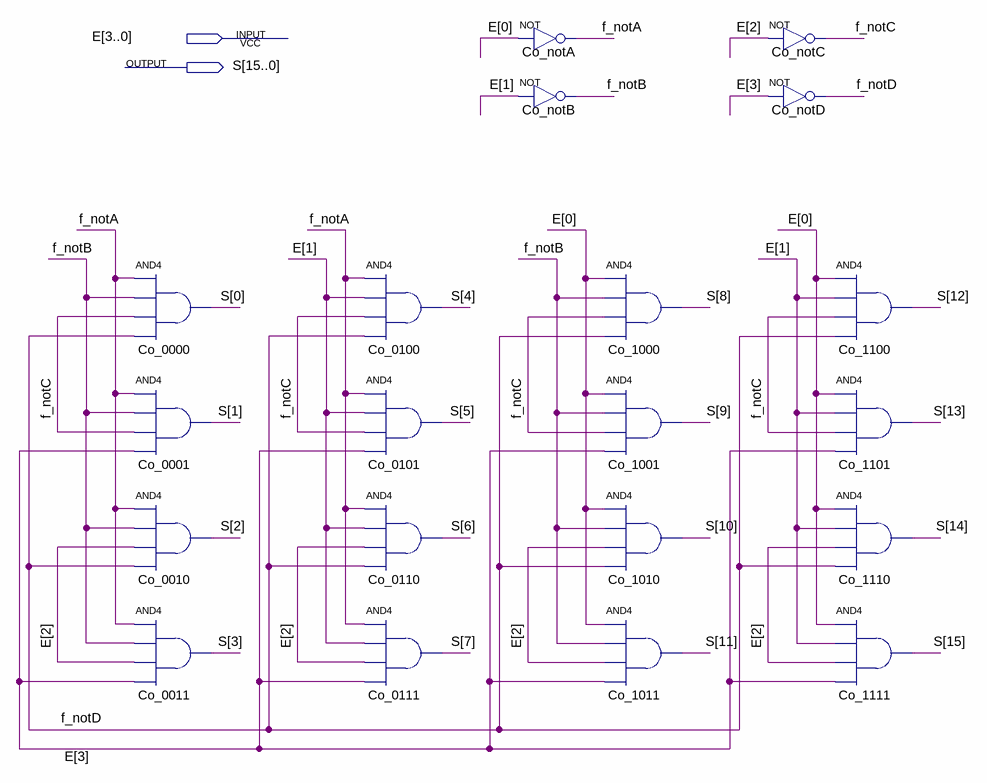
[diagram p0: schematic sheet]
// Quartus schematic decoder4x16.bdf as structural Verilog: 20 symbols, 2 pins
module decoder4x16 (
  input  [3:0] E,
  output [15:0] S
);

  wire f_notA, f_notB, f_notC, f_notD;

  and Co_0000 (S[0], f_notA, f_notB, f_notC, f_notD);
  and Co_0001 (S[1], f_notA, f_notB, f_notC, E[3]);
  and Co_0010 (S[2], f_notA, f_notB, E[2], f_notD);
  and Co_0011 (S[3], f_notA, f_notB, E[2], E[3]);
  and Co_0100 (S[4], f_notA, E[1], f_notC, f_notD);
  and Co_0101 (S[5], f_notA, E[1], f_notC, E[3]);
  and Co_0110 (S[6], f_notA, E[1], E[2], f_notD);
  and Co_0111 (S[7], f_notA, E[1], E[2], E[3]);
  not Co_notA (f_notA, E[0]);
  not Co_notB (f_notB, E[1]);
  and Co_1000 (S[8], E[0], f_notB, f_notC, f_notD);
  and Co_1001 (S[9], E[0], f_notB, f_notC, E[3]);
  and Co_1010 (S[10], E[0], f_notB, E[2], f_notD);
  and Co_1011 (S[11], E[0], f_notB, E[2], E[3]);
  not Co_notC (f_notC, E[2]);
  not Co_notD (f_notD, E[3]);
  and Co_1100 (S[12], E[0], E[1], f_notC, f_notD);
  and Co_1101 (S[13], E[0], E[1], f_notC, E[3]);
  and Co_1110 (S[14], E[0], E[1], E[2], f_notD);
  and Co_1111 (S[15], E[0], E[1], E[2], E[3]);
endmodule
